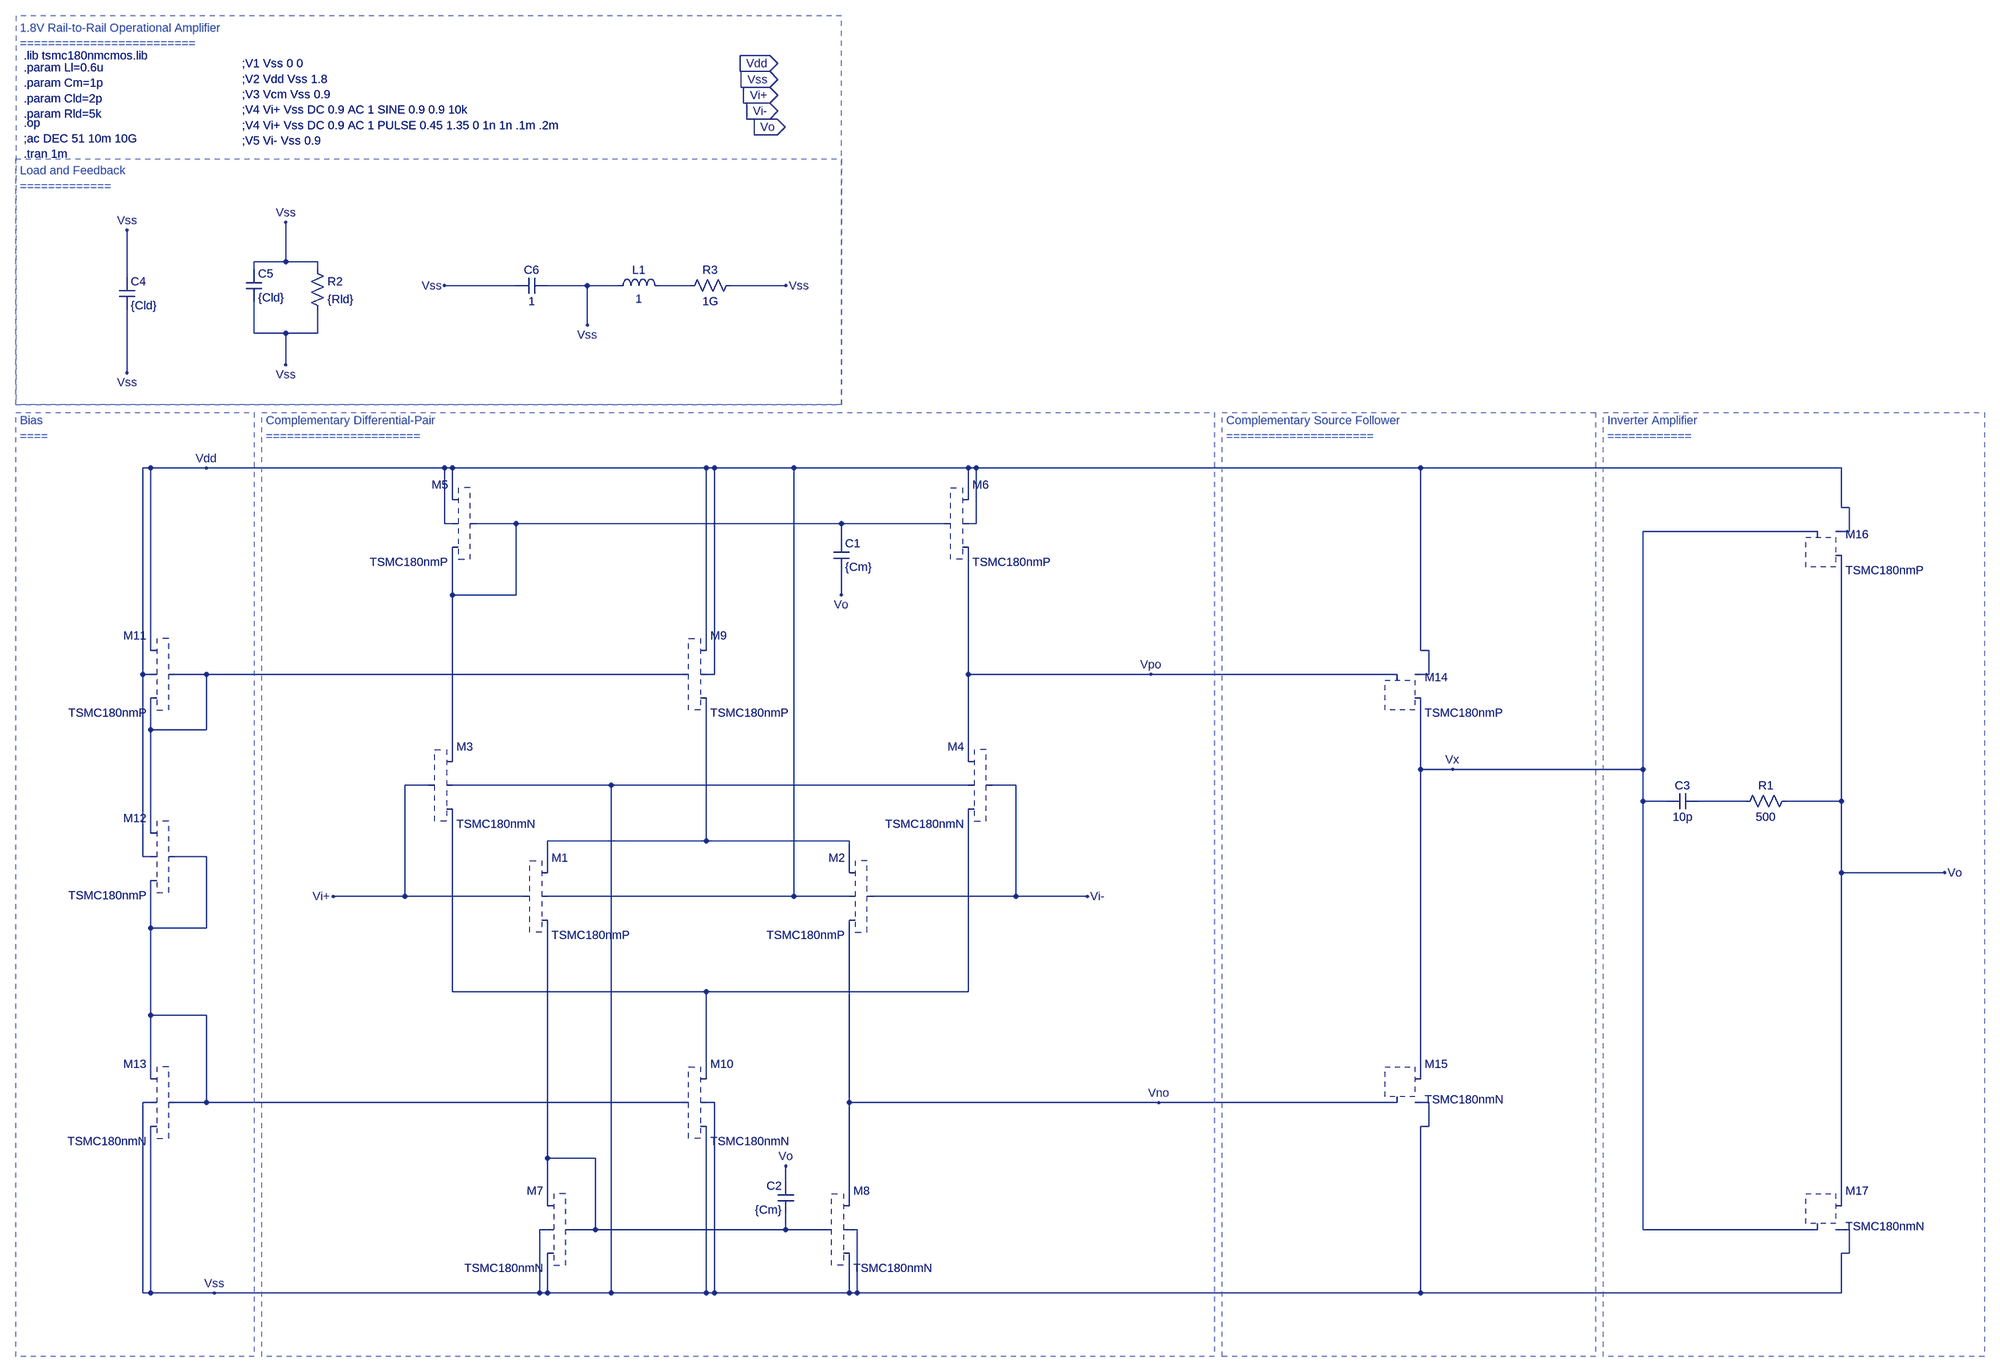
[diagram p0: schematic OAR830.asc]
OAR830.asc, the LTspice schematic file:
Version 4
SHEET 1 5940 1556
WIRE -1744 -656 -1744 -736
WIRE -1744 -656 -1808 -656
WIRE -1680 -656 -1744 -656
WIRE -1808 -640 -1808 -656
WIRE -1680 -640 -1680 -656
WIRE -2064 -624 -2064 -720
WIRE -1280 -608 -1424 -608
WIRE -1136 -608 -1216 -608
WIRE -1072 -608 -1136 -608
WIRE -928 -608 -992 -608
WIRE -736 -608 -848 -608
WIRE -1136 -528 -1136 -608
WIRE -1808 -512 -1808 -576
WIRE -1744 -512 -1808 -512
WIRE -1680 -512 -1680 -560
WIRE -1680 -512 -1744 -512
WIRE -1744 -448 -1744 -512
WIRE -2064 -432 -2064 -560
WIRE -2016 -240 -2032 -240
WIRE -1904 -240 -2016 -240
WIRE -1424 -240 -1904 -240
WIRE -1408 -240 -1424 -240
WIRE -896 -240 -1408 -240
WIRE -880 -240 -896 -240
WIRE -720 -240 -880 -240
WIRE -368 -240 -720 -240
WIRE -352 -240 -368 -240
WIRE 544 -240 -352 -240
WIRE 1392 -240 544 -240
WIRE -1408 -176 -1408 -240
WIRE -368 -176 -368 -240
WIRE 1392 -160 1392 -240
WIRE 1408 -160 1392 -160
WIRE -1424 -128 -1424 -240
WIRE -1408 -128 -1424 -128
WIRE -1280 -128 -1360 -128
WIRE -624 -128 -1280 -128
WIRE -416 -128 -624 -128
WIRE -352 -128 -352 -240
WIRE -352 -128 -368 -128
WIRE 1344 -112 992 -112
WIRE 1408 -112 1408 -160
WIRE 1408 -112 1392 -112
WIRE -624 -96 -624 -128
WIRE -1408 16 -1408 -80
WIRE -1280 16 -1280 -128
WIRE -1280 16 -1408 16
WIRE -624 16 -624 -32
WIRE -2016 128 -2016 -240
WIRE -896 128 -896 -240
WIRE 544 128 544 -240
WIRE 560 128 544 128
WIRE -2032 176 -2032 -240
WIRE -2016 176 -2032 176
WIRE -1904 176 -1968 176
WIRE -944 176 -1904 176
WIRE -880 176 -880 -240
WIRE -880 176 -896 176
WIRE -368 176 -368 -80
WIRE 0 176 -368 176
WIRE 496 176 0 176
WIRE 560 176 560 128
WIRE 560 176 544 176
WIRE -2016 288 -2016 224
WIRE -1904 288 -1904 176
WIRE -1904 288 -2016 288
WIRE -1408 352 -1408 16
WIRE -368 352 -368 176
WIRE 544 368 544 224
WIRE 608 368 544 368
WIRE 992 368 992 -112
WIRE 992 368 608 368
WIRE -1456 400 -1504 400
WIRE -1088 400 -1408 400
WIRE -368 400 -1088 400
WIRE -272 400 -320 400
WIRE 992 432 992 368
WIRE 1040 432 992 432
WIRE 1200 432 1104 432
WIRE 1392 432 1392 -64
WIRE 1392 432 1280 432
WIRE -2016 496 -2016 288
WIRE -896 512 -896 224
WIRE -896 512 -1216 512
WIRE -608 512 -896 512
WIRE -2032 544 -2032 176
WIRE -2016 544 -2032 544
WIRE -1904 544 -1968 544
WIRE -1216 576 -1216 512
WIRE -608 576 -608 512
WIRE 1392 576 1392 432
WIRE 1600 576 1392 576
WIRE -1504 624 -1504 400
WIRE -1504 624 -1648 624
WIRE -1264 624 -1504 624
WIRE -720 624 -720 -240
WIRE -720 624 -1216 624
WIRE -608 624 -720 624
WIRE -272 624 -272 400
WIRE -272 624 -560 624
WIRE -128 624 -272 624
WIRE -2016 688 -2016 592
WIRE -1904 688 -1904 544
WIRE -1904 688 -2016 688
WIRE -1408 816 -1408 448
WIRE -896 816 -1408 816
WIRE -368 816 -368 448
WIRE -368 816 -896 816
WIRE -2016 864 -2016 688
WIRE -1904 864 -2016 864
WIRE -2016 992 -2016 864
WIRE -896 992 -896 816
WIRE 544 992 544 368
WIRE -2016 1040 -2032 1040
WIRE -1904 1040 -1904 864
WIRE -1904 1040 -1968 1040
WIRE -944 1040 -1904 1040
WIRE -880 1040 -896 1040
WIRE -608 1040 -608 672
WIRE 16 1040 -608 1040
WIRE 496 1040 16 1040
WIRE 560 1040 544 1040
WIRE 560 1088 560 1040
WIRE 560 1088 544 1088
WIRE -1216 1152 -1216 672
WIRE -1120 1152 -1216 1152
WIRE -736 1200 -736 1168
WIRE -1216 1248 -1216 1152
WIRE -608 1248 -608 1040
WIRE 1392 1248 1392 576
WIRE -1216 1296 -1232 1296
WIRE -1120 1296 -1120 1152
WIRE -1120 1296 -1168 1296
WIRE -736 1296 -736 1264
WIRE -736 1296 -1120 1296
WIRE -656 1296 -736 1296
WIRE -592 1296 -608 1296
WIRE 992 1296 992 432
WIRE 1344 1296 992 1296
WIRE 1408 1296 1392 1296
WIRE 1408 1344 1408 1296
WIRE 1408 1344 1392 1344
WIRE -2032 1424 -2032 1040
WIRE -2016 1424 -2016 1088
WIRE -2016 1424 -2032 1424
WIRE -1888 1424 -2016 1424
WIRE -1232 1424 -1232 1296
WIRE -1232 1424 -1888 1424
WIRE -1216 1424 -1216 1344
WIRE -1216 1424 -1232 1424
WIRE -1088 1424 -1088 400
WIRE -1088 1424 -1216 1424
WIRE -896 1424 -896 1088
WIRE -896 1424 -1088 1424
WIRE -880 1424 -880 1040
WIRE -880 1424 -896 1424
WIRE -608 1424 -608 1344
WIRE -608 1424 -880 1424
WIRE -592 1424 -592 1296
WIRE -592 1424 -608 1424
WIRE 544 1424 544 1088
WIRE 544 1424 -592 1424
WIRE 1392 1424 1392 1344
WIRE 1392 1424 544 1424
FLAG -752 -1056 Vdd
IOPIN -752 -1056 In
FLAG -752 -1024 Vss
IOPIN -752 -1024 In
FLAG -752 -992 Vi+
IOPIN -752 -992 In
FLAG -752 -960 Vi-
IOPIN -752 -960 In
FLAG -800 -928 Vo
IOPIN -800 -928 Out
FLAG -1648 624 Vi+
FLAG -128 624 Vi-
FLAG -1904 -240 Vdd
FLAG -1888 1424 Vss
FLAG -624 16 Vo
FLAG 0 176 Vpo
FLAG 16 1040 Vno
FLAG 1600 576 Vo
FLAG -736 1168 Vo
FLAG -1424 -608 Vss
FLAG -1136 -528 Vss
FLAG -736 -608 Vss
FLAG -1744 -736 Vss
FLAG -1744 -448 Vss
FLAG -2064 -720 Vss
FLAG -2064 -432 Vss
FLAG 608 368 Vx
DATAFLAG -896 512 ""
DATAFLAG -1712 176 ""
DATAFLAG -272 176 ""
DATAFLAG -128 1040 ""
DATAFLAG -1600 624 ""
DATAFLAG -208 624 ""
DATAFLAG -896 816 ""
DATAFLAG -1088 464 ""
DATAFLAG -992 1296 ""
DATAFLAG -1152 -128 ""
DATAFLAG -1216 752 ""
DATAFLAG -1408 32 ""
DATAFLAG -720 464 ""
DATAFLAG -1696 1040 ""
DATAFLAG -896 912 "Id(M10)"
DATAFLAG -896 320 "Id(M5)"
DATAFLAG -2016 768 "Id(M17)"
DATAFLAG 848 368 ""
DATAFLAG -1408 256 "Id(M3)"
DATAFLAG -1216 1136 "Id(M8)"
DATAFLAG -608 1136 "Id(M9)"
DATAFLAG -608 752 ""
DATAFLAG -368 0 ""
DATAFLAG -368 240 "Id(M4)"
DATAFLAG 544 624 "Id(M14)"
DATAFLAG 1488 576 ""
DATAFLAG 1392 48 "Id(M15)"
DATAFLAG -1152 -608 ""
DATAFLAG -1344 -608 ""
DATAFLAG -784 -608 ""
SYMBOL pmos_t18 -416 -176 R0
SYMATTR InstName M6
SYMATTR Value2 l={Ll} w=20u
SYMATTR SpiceLine ""
SYMATTR SpiceModel ""
SYMATTR Value TSMC180nmP
SYMBOL pmos_t18 -1360 -176 M0
SYMATTR InstName M5
SYMATTR Value2 l={Ll} w=20u
SYMATTR SpiceLine ""
SYMATTR SpiceModel ""
SYMATTR Value TSMC180nmP
SYMBOL nmos_t18 -1456 352 R0
SYMATTR InstName M3
SYMATTR Value2 l={Ll} w=10u
SYMATTR SpiceLine ""
SYMATTR SpiceModel ""
SYMATTR Value TSMC180nmN
SYMBOL nmos_t18 -320 352 M0
SYMATTR InstName M4
SYMATTR Value2 l={Ll} w=10u
SYMATTR SpiceLine ""
SYMATTR SpiceModel ""
SYMATTR Value TSMC180nmN
SYMBOL pmos_t18 -944 128 R0
SYMATTR InstName M9
SYMATTR Value2 l={Ll} w=20u m=3
SYMATTR SpiceLine ""
SYMATTR SpiceModel ""
SYMATTR Value TSMC180nmP
SYMBOL pmos_t18 -1264 576 R0
SYMATTR InstName M1
SYMATTR Value2 l={Ll} w=10u
SYMATTR SpiceLine ""
SYMATTR SpiceModel ""
SYMATTR Value TSMC180nmP
SYMBOL pmos_t18 -560 576 M0
SYMATTR InstName M2
SYMATTR Value2 l={Ll} w=10u
SYMATTR SpiceLine ""
SYMATTR SpiceModel ""
SYMATTR Value TSMC180nmP
SYMBOL nmos_t18 -1168 1248 M0
SYMATTR InstName M7
SYMATTR Value2 l={Ll} w=20u
SYMATTR SpiceLine ""
SYMATTR SpiceModel ""
SYMATTR Value TSMC180nmN
SYMBOL nmos_t18 -656 1248 R0
SYMATTR InstName M8
SYMATTR Value2 l={Ll} w=20u
SYMATTR SpiceLine ""
SYMATTR SpiceModel ""
SYMATTR Value TSMC180nmN
SYMBOL nmos_t18 -944 992 R0
SYMATTR InstName M10
SYMATTR Value2 l={Ll} w=20u m=3
SYMATTR SpiceLine ""
SYMATTR SpiceModel ""
SYMATTR Value TSMC180nmN
SYMBOL pmos_t18 -1968 128 M0
SYMATTR InstName M11
SYMATTR Value2 l={Ll} w=20u
SYMATTR SpiceLine ""
SYMATTR SpiceModel ""
SYMATTR Value TSMC180nmP
SYMBOL nmos_t18 -1968 992 M0
SYMATTR InstName M13
SYMATTR Value2 l={Ll} w=20u
SYMATTR SpiceLine ""
SYMATTR SpiceModel ""
SYMATTR Value TSMC180nmN
SYMBOL pmos_t18 496 128 R0
SYMATTR InstName M14
SYMATTR Value2 l={Ll} w=40u m=40
SYMATTR SpiceLine ""
SYMATTR SpiceModel ""
SYMATTR Value TSMC180nmP
SYMBOL nmos_t18 496 992 R0
SYMATTR InstName M15
SYMATTR Value2 l={Ll} w=40u m=40
SYMATTR SpiceLine ""
SYMATTR SpiceModel ""
SYMATTR Value TSMC180nmN
SYMBOL pmos_t18 1344 -160 R0
SYMATTR InstName M16
SYMATTR Value2 l={Ll} w=40u m=20
SYMATTR SpiceLine ""
SYMATTR SpiceModel ""
SYMATTR Value TSMC180nmP
SYMBOL nmos_t18 1344 1248 R0
SYMATTR InstName M17
SYMATTR Value2 l={Ll} w=10u m=20
SYMATTR SpiceLine ""
SYMATTR SpiceModel ""
SYMATTR Value TSMC180nmN
SYMBOL cap 1104 416 R90
WINDOW 0 0 32 VBottom 2
WINDOW 3 32 32 VTop 2
SYMATTR InstName C3
SYMATTR Value 10p
SYMBOL cap -640 -96 R0
SYMATTR InstName C1
SYMATTR Value {Cm}
SYMBOL cap -720 1264 R180
WINDOW 0 24 56 Left 2
WINDOW 3 24 8 Left 2
SYMATTR InstName C2
SYMATTR Value {Cm}
SYMBOL res -832 -624 R90
WINDOW 0 0 56 VBottom 2
WINDOW 3 32 56 VTop 2
SYMATTR InstName R3
SYMATTR Value 1G
SYMBOL ind -1088 -592 R270
WINDOW 0 32 56 VTop 2
WINDOW 3 5 56 VBottom 2
SYMATTR InstName L1
SYMATTR Value 1
SYMBOL cap -1216 -624 R90
WINDOW 0 0 32 VBottom 2
WINDOW 3 32 32 VTop 2
SYMATTR InstName C6
SYMATTR Value 1
SYMBOL cap -1824 -640 R0
SYMATTR InstName C5
SYMATTR Value {Cld}
SYMBOL cap -2080 -624 R0
SYMATTR InstName C4
SYMATTR Value {Cld}
SYMBOL res -1696 -656 R0
SYMATTR InstName R2
SYMATTR Value {Rld}
SYMBOL res 1296 416 R90
WINDOW 0 0 56 VBottom 2
WINDOW 3 32 56 VTop 2
SYMATTR InstName R1
SYMATTR Value 500
SYMBOL pmos_t18 -1968 496 M0
SYMATTR InstName M12
SYMATTR Value2 l={Ll} w=22u m=2
SYMATTR SpiceLine ""
SYMATTR SpiceModel ""
SYMATTR Value TSMC180nmP
TEXT -2272 -1072 Left 2 !.lib tsmc180nmcmos.lib
TEXT -2272 -1048 Left 2 !.param Ll=0.6u\n.param Cm=1p\n.param Cld=2p\n.param Rld=5k
TEXT -1832 -1056 Left 2 !;V1 Vss 0 0\n;V2 Vdd Vss 1.8\n;V3 Vcm Vss 0.9\n;V4 Vi+ Vss DC 0.9 AC 1 SINE 0.9 0.9 10k\n;V4 Vi+ Vss DC 0.9 AC 1 PULSE 0.45 1.35 0 1n 1n .1m .2m\n;V5 Vi- Vss 0.9
TEXT -2272 -936 Left 2 !.op\n;ac DEC 51 10m 10G\n.tran 1m
TEXT -2280 -1128 Left 2 ;1.8V Rail-to-Rail Operational Amplifier\n=========================
TEXT -2280 -336 Left 2 ;Bias\n====
TEXT -1784 -336 Left 2 ;Complementary Differential-Pair\n======================
TEXT 152 -336 Left 2 ;Complementary Source Follower\n=====================
TEXT 920 -336 Left 2 ;Inverter Amplifier\n============
TEXT -2280 -840 Left 2 ;Load and Feedback\n=============
RECTANGLE Normal -1808 1552 -2288 -352 2
RECTANGLE Normal 128 1552 -1792 -352 2
RECTANGLE Normal 896 1552 144 -352 2
RECTANGLE Normal 1680 1552 912 -352 2
RECTANGLE Normal -624 -1152 -2288 -368 2
RECTANGLE Normal -624 -368 -2288 -864 2

The netlist it stands for:
* OAR830.asc
* M6: TSMC180nmP l={Ll} w=20u (symbol pmos_t18 not available, pin order unknown); nets seen at it: N002, Vdd, Vpo
* M5: TSMC180nmP l={Ll} w=20u (symbol pmos_t18 not available, pin order unknown); nets seen at it: N002, Vdd
* M3: TSMC180nmN l={Ll} w=10u (symbol nmos_t18 not available, pin order unknown); nets seen at it: N002, N007, Vi+, Vss
* M4: TSMC180nmN l={Ll} w=10u (symbol nmos_t18 not available, pin order unknown); nets seen at it: N007, Vi-, Vpo, Vss
* M9: TSMC180nmP l={Ll} w=20u m=3 (symbol pmos_t18 not available, pin order unknown); nets seen at it: N003, N005, Vdd
* M1: TSMC180nmP l={Ll} w=10u (symbol pmos_t18 not available, pin order unknown); nets seen at it: N005, N008, Vdd, Vi+
* M2: TSMC180nmP l={Ll} w=10u (symbol pmos_t18 not available, pin order unknown); nets seen at it: N005, Vdd, Vi-, Vno
* M7: TSMC180nmN l={Ll} w=20u (symbol nmos_t18 not available, pin order unknown); nets seen at it: N008, Vss
* M8: TSMC180nmN l={Ll} w=20u (symbol nmos_t18 not available, pin order unknown); nets seen at it: N008, Vno, Vss
* M10: TSMC180nmN l={Ll} w=20u m=3 (symbol nmos_t18 not available, pin order unknown); nets seen at it: N006, N007, Vss
* M11: TSMC180nmP l={Ll} w=20u (symbol pmos_t18 not available, pin order unknown); nets seen at it: N003, Vdd
* M13: TSMC180nmN l={Ll} w=20u (symbol nmos_t18 not available, pin order unknown); nets seen at it: N006, Vss
* M14: TSMC180nmP l={Ll} w=40u m=40 (symbol pmos_t18 not available, pin order unknown); nets seen at it: Vdd, Vpo, Vx
* M15: TSMC180nmN l={Ll} w=40u m=40 (symbol nmos_t18 not available, pin order unknown); nets seen at it: Vno, Vss, Vx
* M16: TSMC180nmP l={Ll} w=40u m=20 (symbol pmos_t18 not available, pin order unknown); nets seen at it: Vdd, Vo, Vx
* M17: TSMC180nmN l={Ll} w=10u m=20 (symbol nmos_t18 not available, pin order unknown); nets seen at it: Vo, Vss, Vx
C3 N004 Vx 10p
C1 N002 Vo {Cm}
C2 N008 Vo {Cm}
R3 Vss N001 1G
L1 Vss N001 1
C6 Vss Vss 1
C5 Vss Vss {Cld}
C4 Vss Vss {Cld}
R2 Vss Vss {Rld}
R1 Vo N004 500
* M12: TSMC180nmP l={Ll} w=22u m=2 (symbol pmos_t18 not available, pin order unknown); nets seen at it: N003, N006, Vdd
.lib tsmc180nmcmos.lib
.param Ll=0.6u
.param Cm=1p
.param Cld=2p
.param Rld=5k
;V1 Vss 0 0
;V2 Vdd Vss 1.8
;V3 Vcm Vss 0.9
;V4 Vi+ Vss DC 0.9 AC 1 SINE 0.9 0.9 10k
;V4 Vi+ Vss DC 0.9 AC 1 PULSE 0.45 1.35 0 1n 1n .1m .2m
;V5 Vi- Vss 0.9
.op
;ac DEC 51 10m 10G
.tran 1m
* 1.8V Rail-to-Rail Operational Amplifier
* =========================
* Bias
* ====
* Complementary Differential-Pair
* ======================
* Complementary Source Follower
* =====================
* Inverter Amplifier
* ============
* Load and Feedback
* =============
.backanno
.end